# Altium schematic sheet 10 - Configuration And ADC.SchDoc: Configuration and ADC
size A3; Page Number: 10; Page Size: B; Page Count: 12; Board Rev: B; Project Name: CrossLink-NX Evaluation Board; RevCode: 1.0; Doc: 305-PD-19-0819; DsnPath: C:\Users\HAltinkilit\Downloads\Crosslink-NX-Design-Files\CrossLink-NX-Eval-Brd-Schematic-RevB-191122.DSN; SchematicName: SCHEMATIC1; PageName: 09 - Configuration And ADC; PageSize: B; TopSchematic: True
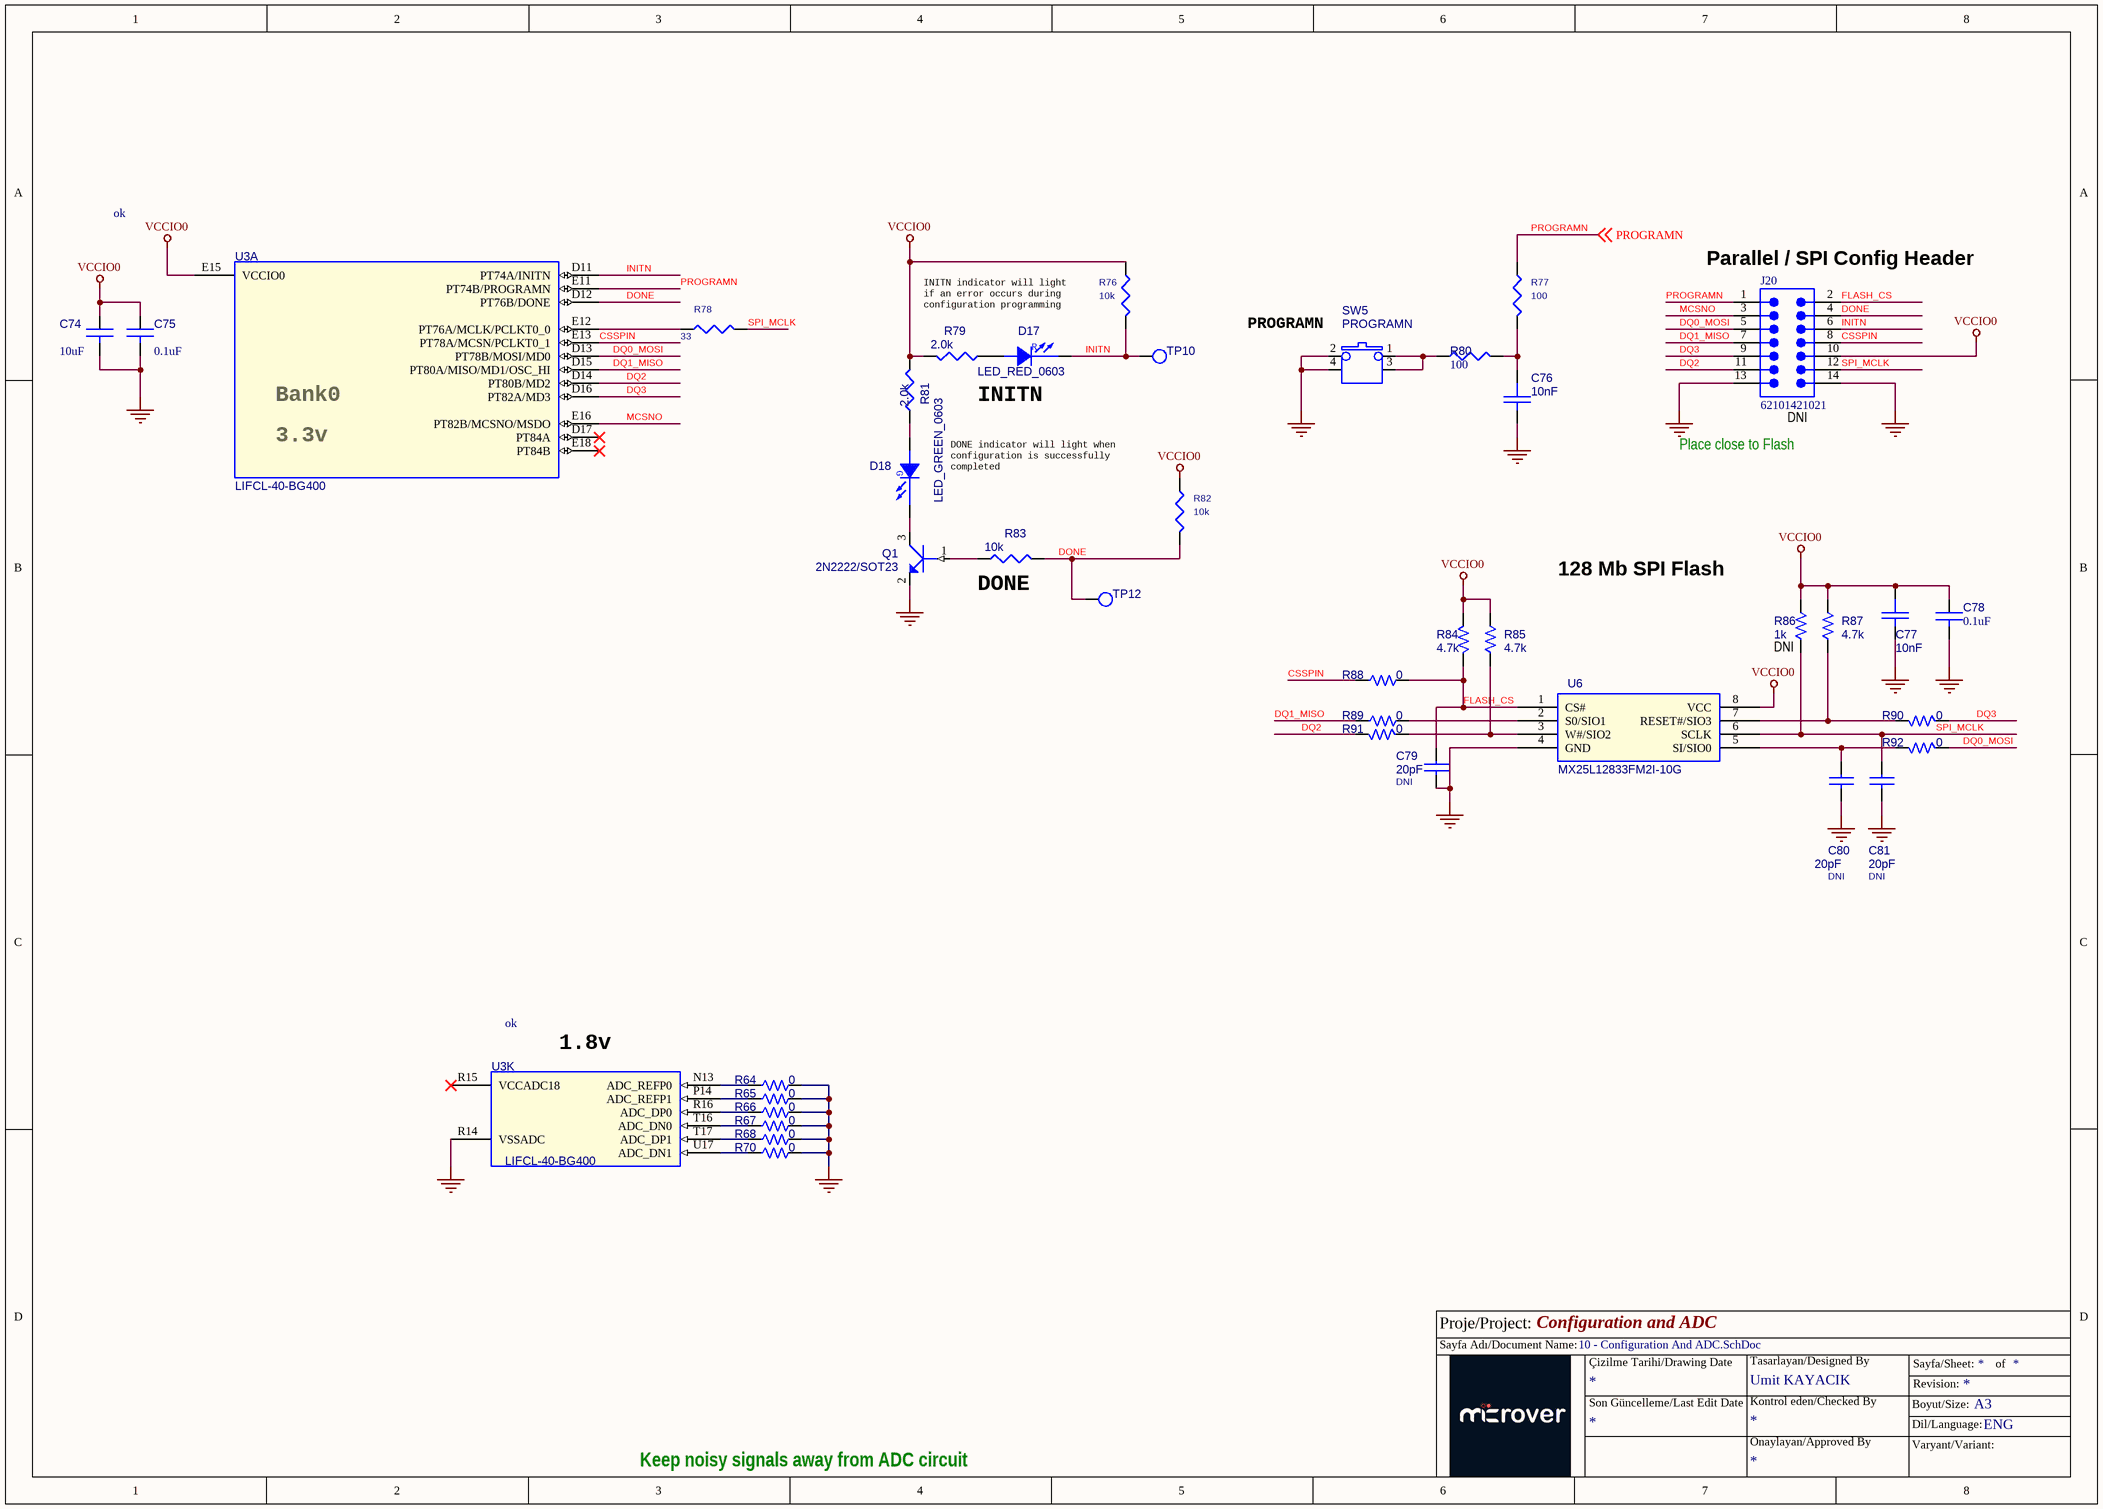
[diagram p0: 10 - Configuration And ADC.SchDoc]

## Parts
C74  10uF  [C0603]
C75  0.1uF  [C0201]
C76  10nF  [RLP-130-A]
C77  10nF  [RLP-130-A]
C78  0.1uF  [C0402]
C79  20pF  populate: DNI  [C0402]
C80  20pF  populate: DNI  [C0402]
C81  20pF  populate: DNI  [c0402]
D17  LED_RED_0603  [APT1608]
D18  LED_GREEN_0603  [APT1608]
J20  62101421021  [62101421021]
Q1  2N2222/SOT23  [MMBT2222ALT-1]
R64  0  [R0201]
R65  0  [R0201]
R66  0  [R0201]
R67  0  [R0201]
R68  0  [R0201]
R70  0  [R0201]
R76  10k  [R0402]
R77  100  [R0402]
R78  33  [R0402]
R79  2.0k  [R0402]
R80  100  [R0402]
R81  2.0k  [R0402]
R82  10k  [R0402]
R83  10k  [R0402]
R84  4.7k  [R0402]
R85  4.7k  [R0402]
R86  1k  [R0402]
R87  4.7k  [R0402]
R88  0  [R0402]
R89  0  [R0402]
R90  0  [R0402]
R91  0  [R0402]
R92  0  [R0402]
SW5  PROGRAMN  [4psmd_switch]
TP10  TestPoint  [TP_1MM]  (value not drawn)
TP12  TestPoint  [TP_1MM]  (value not drawn)
U3  LIFCL-40-BG400  [LIFCL-40-BG400]  (parts A,K of 15)
U6  MX25L12833FM2I-10G  [SO8_MX25L12833FM2I10G]

## Nets
GND: C74.2 C75.2 C76.2 C77.2 C78.2 C79.2 C80.2 C81.2 J20.13 J20.14 Q1.2(EMITTER) R64.2 R65.2 R66.2 R67.2 R68.2 R70.2 SW5.2 SW5.4 U3.R14(VSSADC) U6.4(GND)
VCCIO0: C74.1 C75.1 C77.1 C78.1 J20.10 R76.1 R79.2 R81.2 R82.1 R84.2 R85.2 R86.2 R87.2 U3.E15(VCCIO0) U6.8(VCC)
CSSPIN: J20.8 R88.1 U3.E13(PT78A/MCSN/PCLKT0_1)
DONE: J20.4 R82.2 R83.2 TP12.1(TP) U3.D12(PT76B/DONE)
DQ0_MOSI: J20.5 R92.1 U3.D13(PT78B/MOSI/MD0)
DQ1_MISO: J20.7 R89.1 U3.D15(PT80A/MISO/MD1/OSC_HI)
DQ2: J20.11 R91.2 U3.D14(PT80B/MD2)
DQ3: J20.9 R90.1 U3.D16(PT82A/MD3)
FLASH_CS: C79.1 J20.2 R84.1 R88.2 U6.1(CS#)
INITN: D17.1(CATHODE) J20.6 R76.2 TP10.1(TP) U3.D11(PT74A/INITN)
MCSNO: J20.3 U3.E16(PT82B/MCSNO/MSDO)
PROGRAMN: J20.1 R77.1 U3.E11(PT74B/PROGRAMN) ; off-sheet PROGRAMN
SPI_MCLK: C81.1 J20.12 R78.1 R86.1 U6.6(SCLK)
NetC76_1: C76.1 R77.2 R80.2
NetC80_1: C80.1 R92.2 U6.5(SI/SIO0)
NetD17_2: D17.2(ANODE) R79.1
NetD18_1: D18.1(CATHODE) Q1.3(COLLECTOR)
NetD18_2: D18.2(ANODE) R81.1
NetQ1_1: Q1.1(BASE) R83.1
NetR64_1: R64.1 U3.N13(ADC_REFP0)
NetR65_1: R65.1 U3.P14(ADC_REFP1)
NetR66_1: R66.1 U3.R16(ADC_DP0)
NetR67_1: R67.1 U3.T16(ADC_DN0)
NetR68_1: R68.1 U3.T17(ADC_DP1)
NetR70_1: R70.1 U3.U17(ADC_DN1)
NetR78_2: R78.2 U3.E12(PT76A/MCLK/PCLKT0_0)
NetR80_1: R80.1 SW5.1 SW5.3
NetR85_1: R85.1 R91.1 U6.3(W#/SIO2)
NetR87_1: R87.1 R90.2 U6.7(RESET#/SIO3)
NetR89_2: R89.2 U6.2(S0/SIO1)

Not connected (* = marked no-connect by the designer): U3 D17(PT84A)* E18(PT84B)* R15(VCCADC18)*

## Notes on the sheet
- ok
- (near R76) INITN indicator will light
  if an error occurs during
  configuration programming
- (near J20) Parallel / SPI Config Header
- (near SW5) PROGRAMN
- (near U3) 3.3v
- (near U3) Bank0
- INITN
- Place close to Flash
- (near J20) DNI
- DONE indicator will light when
  configuration is successfully
  completed
- 128 Mb SPI Flash
- (near R83) DONE
- (near R86) DNI
- (near U3) 1.8v
- Keep noisy signals away from ADC circuit
- Proje/Project:
- Sayfa Adı/Document Name:
- Çizilme Tarihi/Drawing Date
- Umit KAYACIK
- Tasarlayan/Designed By
- Sayfa/Sheet:
- Revision:
- of
- Son Güncelleme/Last Edit Date
- Kontrol eden/Checked By
- Onaylayan/Approved By
- Boyut/Size:
- Varyant/Variant:
- Dil/Language:
- A3
- ENG
- (in symbol LED-SMT1206_GREEN_1) G
- (in symbol LED-SMT1206_RED_0) R

## Library data of the parts
C74 = 10uF_0603: CAP CECAP CER 10UF 10V X5R 20% 0603; Manufacturer: Taiyo Yuden; Manufacturer Part Number: LMK107BJ106MALTD; Part Reference: C74; Class: Discrete; Digikey P/N: 587-2562-1-ND; Assy: -; Value: 10uF; PCB Footprint: C0603
C75 = 0u1_0402: CAP CER 0.1UF 25V 10% X5R 0201; Manufacturer: Murata; Manufacturer Part Number: GRM033R61E104KE14J; Part Reference: C75; Class: Discrete; Digikey P/N: 399-3521-2-ND; Assy: -; Value: 0.1uF; PCB Footprint: C0201
C76 = CAP_1: Part Reference: C76; Value: 10nF; Assy: -; PCB Footprint: RLP-130-A
C77 = CAP_1: Part Reference: C77; Value: 10nF; PCB Footprint: RLP-130-A; Assy: -
C78 = 0u1_0402: CAP CER 0.1UF 25V 10% X5R 0402; Manufacturer: Murata; Manufacturer Part Number: GRM033R61E104KE14J; Part Reference: C78; Class: Discrete; PCB Footprint: C0201; Digikey P/N: 399-3521-2-ND; Assy: -; Value: 0.1uF
C79 = CAP NP_Dup1: Part Reference: C79; Assy: DNI; COMPHEIGHT: 0.000; MEMORY: NO; COMPGROUP: 0; COMPROT: 270; COMPLOC: [1820.000,2015.000]; COMPSIDE: TOP; FPLIST: SM/C_0402; PCB Footprint: RLP-132; Value: 20pF; DECOUPLER: NO; COMPKEY: NO; COMPLOCKED: NO; COMPFIXED: NO
C80 = CAP NP_Dup1: Part Reference: C80; COMPHEIGHT: 0.000; MEMORY: NO; COMPGROUP: 0; COMPROT: 270; COMPLOC: [1820.000,2015.000]; COMPSIDE: TOP; FPLIST: SM/C_0402; Assy: DNI; PCB Footprint: RLP-132; Value: 20pF; DECOUPLER: NO; COMPKEY: NO; COMPLOCKED: NO; COMPFIXED: NO
C81 = CAP NP_Dup1: Part Reference: C81; Assy: DNI; COMPHEIGHT: 0.000; MEMORY: NO; COMPGROUP: 0; COMPROT: 270; COMPLOC: [1820.000,2015.000]; COMPSIDE: TOP; FPLIST: SM/C_0402; PCB Footprint: RLP-132; Value: 20pF; DECOUPLER: NO; COMPKEY: NO; COMPLOCKED: NO; COMPFIXED: NO
D17 = LED-SMT1206_RED_0: Part Reference: D17; Value: LED_RED_0603; Assy: -; PCB Footprint: APT1608
D18 = LED-SMT1206_GREEN_1: Part Reference: D18; Value: LED_GREEN_0603; Assy: -; PCB Footprint: APT1608
J20 = CMP-1502-00928-4: Conn, Header, 14Pos, 2Row, 1.27Mm Rohs Compliant: Yes; Contact Resistance: 20mΩ; Gender: Male; Current Rating: 1A; Operating Supply Voltage: 100V; Orientation: Vertical; RoHS: Non-Compliant; Lead Pitch: 1.27mm; Number of Pins: 14
Q1 = 2N2222: Part Reference: Q1; Value: 2N2222/SOT23; Assy: -; PCB Footprint: MMBT2222ALT-1
R64-R68 R70 = R_Dup2: RES SMD 0.0OHM JUMPER 1/10W 0402; Part Reference: R88; Manufacturer Part Number: ERJ-2GE0R00X; Manufacturer: Panasonic; DIST: FLAT; PSpiceTemplate: R^@REFDES %1 %2 ?TOLERANCE|R^@REFDES| @VALUE  ?TOLERANCE|\n.model R^@REFDES RES R=1 DEV=@TOLERANCE%|; VOLTAGE: RVMAX; SLOPE: RSMAX; MAX_TEMP: RTMAX; POWER: RMAX; FPLIST: AX/RC05; COMPSIDE: TOP; COMPLOC: [3325.000,1400.000]; COMPROT: 180; COMPFIXED: NO; COMPHEIGHT: 0.000; PCB Footprint: R0402; Value: 0; Assy: -; COMPGROUP: 0; COMPLOCKED: NO; COMPKEY: NO; DECOUPLER: NO; MEMORY: NO
R76 = R_Dup3: RES SMD 10K OHM 1% 1/16W 0402; Part Reference: R76; Manufacturer Part Number: RC0402FR-0710KL; MFG: Yageo; Value: 10k; Assy: -; Manufacturer: Yageo; MFG P/N: RC0402FR-0710KL; PCB Footprint: R0402
R77 = R_Dup3: RES SMD 100 OHM 1% 1/16W 0402; Part Reference: R77; Manufacturer Part Number: RC0402FR-07100RL; MFG: Yageo; Value: 100; Assy: -; Manufacturer: Yageo; MFG P/N: RC0402FR-07100RL; PCB Footprint: R0402
R78 = R_Dup3: RES SMD 33 OHM 1% 1/10W 0402; Part Reference: R78; Manufacturer Part Number: ERJ-2RKF33R0X; Manufacturer: Panasonic; Value: 33; Assy: -; PCB Footprint: R0402
R79 = RES_0: RES SMD 1K OHM 1% 1/10W 0402; Part Reference: R79; Manufacturer Part Number: ERJ-2RKF1001X; Manufacturer: Panasonic; Value: 2.0k; Assy: -; PCB Footprint: R0402
R80 = 0R_0603: RES SMD 100 OHM 1% 1/16W 0402; Manufacturer: Yageo; Manufacturer Part Number: RC0402FR-07100RL; Part Reference: R80; Class: Discrete; Digikey P/N: 311-0.0GRTR-ND; Assy: -; Value: 100; MFG: Yageo; MFG P/N: RC0402FR-07100RL; PCB Footprint: R0402
R81 = RES_0: RES SMD 1K OHM 1% 1/10W 0402; Part Reference: R81; Manufacturer: Panasonic; Manufacturer Part Number: ERJ-2RKF1001X; Value: 2.0k; Assy: -; PCB Footprint: R0402
R82 = R_Dup3: RES SMD 10K OHM 1% 1/16W 0402; Part Reference: R82; Manufacturer Part Number: RC0402FR-0710KL; MFG: Yageo; Value: 10k; Assy: -; Manufacturer: Yageo; MFG P/N: RC0402FR-0710KL; PCB Footprint: R0402
R83 = RES_0: RES SMD 10K OHM 1% 1/16W 0402; Part Reference: R83; Manufacturer: Yageo; MFG P/N: RC0402FR-0710KL; Value: 10k; Assy: -; MFG: Yageo; Manufacturer Part Number: RC0402FR-0710KL; PCB Footprint: R0402
R84 = R_Dup2: RES SMD 4.7K OHM 5% 1/10W 0402; Part Reference: R84; Manufacturer: Panasonic; DIST: FLAT; PSpiceTemplate: R^@REFDES %1 %2 ?TOLERANCE|R^@REFDES| @VALUE  ?TOLERANCE|\n.model R^@REFDES RES R=1 DEV=@TOLERANCE%|; VOLTAGE: RVMAX; SLOPE: RSMAX; MAX_TEMP: RTMAX; POWER: RMAX; MFG P/N: ERJ-2GEJ472X; COMPHEIGHT: 0.000; MEMORY: NO; COMPGROUP: 0; COMPROT: 180; COMPLOC: [970.000,1160.000]; COMPSIDE: TOP; FPLIST: AX/RC05,SM/R_0603; Value: 4.7k; Assy: -; MFG: Panasonic; Manufacturer Part Number: ERJ-2GEJ472X; DECOUPLER: NO; COMPKEY: NO; COMPLOCKED: NO; COMPFIXED: NO; PCB Footprint: R0402
R85 = R_Dup2: RES SMD 4.7K OHM 5% 1/10W 0402; Part Reference: R85; Manufacturer: Panasonic; DIST: FLAT; PSpiceTemplate: R^@REFDES %1 %2 ?TOLERANCE|R^@REFDES| @VALUE  ?TOLERANCE|\n.model R^@REFDES RES R=1 DEV=@TOLERANCE%|; VOLTAGE: RVMAX; SLOPE: RSMAX; MAX_TEMP: RTMAX; POWER: RMAX; MFG P/N: ERJ-2GEJ472X; COMPHEIGHT: 0.000; MEMORY: NO; COMPGROUP: 0; COMPROT: 180; COMPLOC: [970.000,1160.000]; COMPSIDE: TOP; FPLIST: AX/RC05,SM/R_0603; Value: 4.7k; Assy: -; MFG: Panasonic; Manufacturer Part Number: ERJ-2GEJ472X; DECOUPLER: NO; COMPKEY: NO; COMPLOCKED: NO; COMPFIXED: NO; PCB Footprint: R0402
R86 = R_Dup2: RES SMD 1K OHM 1% 1/10W 0402; Part Reference: R86; Manufacturer Part Number: ERJ-2RKF1001X; Manufacturer: Panasonic; DIST: FLAT; PSpiceTemplate: R^@REFDES %1 %2 ?TOLERANCE|R^@REFDES| @VALUE  ?TOLERANCE|\n.model R^@REFDES RES R=1 DEV=@TOLERANCE%|; VOLTAGE: RVMAX; SLOPE: RSMAX; MAX_TEMP: RTMAX; POWER: RMAX; Assy: DNI; COMPHEIGHT: 0.000; MEMORY: NO; COMPGROUP: 0; COMPROT: 180; COMPLOC: [970.000,1160.000]; COMPSIDE: TOP; FPLIST: AX/RC05,SM/R_0603; Value: 1k; DECOUPLER: NO; COMPKEY: NO; COMPLOCKED: NO; COMPFIXED: NO; PCB Footprint: R0402
R87 = R_Dup2: RES SMD 4.7K OHM 5% 1/10W 0402; Part Reference: R87; Manufacturer: Panasonic; DIST: FLAT; PSpiceTemplate: R^@REFDES %1 %2 ?TOLERANCE|R^@REFDES| @VALUE  ?TOLERANCE|\n.model R^@REFDES RES R=1 DEV=@TOLERANCE%|; VOLTAGE: RVMAX; SLOPE: RSMAX; MAX_TEMP: RTMAX; POWER: RMAX; MFG P/N: ERJ-2GEJ472X; FPLIST: AX/RC05,SM/R_0603; COMPSIDE: TOP; COMPLOC: [970.000,1160.000]; COMPROT: 180; COMPGROUP: 0; COMPFIXED: NO; COMPHEIGHT: 0.000; Value: 4.7k; Assy: -; MFG: Panasonic; Manufacturer Part Number: ERJ-2GEJ472X; COMPLOCKED: NO; COMPKEY: NO; DECOUPLER: NO; MEMORY: NO; PCB Footprint: R0402
R88 = R_Dup2: RES SMD 0.0OHM JUMPER 1/10W 0402; Part Reference: R88; Manufacturer Part Number: ERJ-2GE0R00X; Manufacturer: Panasonic; DIST: FLAT; PSpiceTemplate: R^@REFDES %1 %2 ?TOLERANCE|R^@REFDES| @VALUE  ?TOLERANCE|\n.model R^@REFDES RES R=1 DEV=@TOLERANCE%|; VOLTAGE: RVMAX; SLOPE: RSMAX; MAX_TEMP: RTMAX; POWER: RMAX; FPLIST: AX/RC05; COMPSIDE: TOP; COMPLOC: [3325.000,1400.000]; COMPROT: 180; COMPFIXED: NO; COMPHEIGHT: 0.000; Value: 0; Assy: -; COMPGROUP: 0; COMPLOCKED: NO; COMPKEY: NO; DECOUPLER: NO; MEMORY: NO; PCB Footprint: R0402
R89 = R_Dup2: RES SMD 0.0OHM JUMPER 1/10W 0402; Part Reference: R89; Manufacturer Part Number: ERJ-2GE0R00X; Manufacturer: Panasonic; DIST: FLAT; PSpiceTemplate: R^@REFDES %1 %2 ?TOLERANCE|R^@REFDES| @VALUE  ?TOLERANCE|\n.model R^@REFDES RES R=1 DEV=@TOLERANCE%|; VOLTAGE: RVMAX; SLOPE: RSMAX; MAX_TEMP: RTMAX; POWER: RMAX; FPLIST: AX/RC05; COMPSIDE: TOP; COMPLOC: [3325.000,1400.000]; COMPROT: 180; COMPFIXED: NO; COMPHEIGHT: 0.000; Value: 0; Assy: -; COMPGROUP: 0; COMPLOCKED: NO; COMPKEY: NO; DECOUPLER: NO; MEMORY: NO; PCB Footprint: R0402
R90 = R_Dup2: RES SMD 0.0OHM JUMPER 1/10W 0402; Part Reference: R90; Manufacturer Part Number: ERJ-2GE0R00X; Manufacturer: Panasonic; DIST: FLAT; PSpiceTemplate: R^@REFDES %1 %2 ?TOLERANCE|R^@REFDES| @VALUE  ?TOLERANCE|\n.model R^@REFDES RES R=1 DEV=@TOLERANCE%|; VOLTAGE: RVMAX; SLOPE: RSMAX; MAX_TEMP: RTMAX; POWER: RMAX; COMPHEIGHT: 0.000; MEMORY: NO; COMPROT: 180; COMPLOC: [3325.000,1400.000]; COMPSIDE: TOP; FPLIST: AX/RC05; Value: 0; Assy: -; DECOUPLER: NO; COMPKEY: NO; COMPLOCKED: NO; COMPFIXED: NO; COMPGROUP: 0; PCB Footprint: R0402
R91 = R_Dup2: RES SMD 0.0OHM JUMPER 1/10W 0402; Part Reference: R91; Manufacturer Part Number: ERJ-2GE0R00X; Manufacturer: Panasonic; DIST: FLAT; PSpiceTemplate: R^@REFDES %1 %2 ?TOLERANCE|R^@REFDES| @VALUE  ?TOLERANCE|\n.model R^@REFDES RES R=1 DEV=@TOLERANCE%|; VOLTAGE: RVMAX; SLOPE: RSMAX; MAX_TEMP: RTMAX; POWER: RMAX; COMPHEIGHT: 0.000; MEMORY: NO; COMPROT: 180; COMPLOC: [3325.000,1400.000]; COMPSIDE: TOP; FPLIST: AX/RC05; Value: 0; Assy: -; DECOUPLER: NO; COMPKEY: NO; COMPLOCKED: NO; COMPFIXED: NO; COMPGROUP: 0; PCB Footprint: R0402
R92 = R_Dup2: RES SMD 0.0OHM JUMPER 1/10W 0402; Part Reference: R92; Manufacturer Part Number: ERJ-2GE0R00X; Manufacturer: Panasonic; DIST: FLAT; PSpiceTemplate: R^@REFDES %1 %2 ?TOLERANCE|R^@REFDES| @VALUE  ?TOLERANCE|\n.model R^@REFDES RES R=1 DEV=@TOLERANCE%|; VOLTAGE: RVMAX; SLOPE: RSMAX; MAX_TEMP: RTMAX; POWER: RMAX; FPLIST: AX/RC05; COMPSIDE: TOP; COMPLOC: [3325.000,1400.000]; COMPROT: 180; COMPFIXED: NO; COMPHEIGHT: 0.000; Value: 0; Assy: -; COMPGROUP: 0; COMPLOCKED: NO; COMPKEY: NO; DECOUPLER: NO; MEMORY: NO; PCB Footprint: R0402
SW5 = SW PUSHBUTTON-SPST/SM: SWITCH TACTILE SPST-NO 0.05A 12V; Part Reference: SW5; Manufacturer Part Number: 434153017835; MFG: Wurth; Value: PROGRAMN; Assy: -; Man. Part #: 434153017835; Manufacturer: Wurth; MFG P/N: 434153017835; PCB Footprint: 4psmd_switch
TP10 = T POINT R: Part Reference: TP10; PCB Footprint: TP50; Value: TestPoint; Assy: -
TP12 = T POINT R: Part Reference: TP12; PCB Footprint: TP50; Value: TestPoint; Assy: -
U3 = LIFCL-40-BG400: Part Reference: U3; SWAP_INFO: (S1+S2+S3+S4+S5+S6+S7+S8+S9+S10+S11+S12+S13+S14+S15); SPLIT_INST: TRUE; Value: LIFCL-40-BG400; Assy: -; PCB Footprint: LIFCL-40-BG400
U6 = N25QxxxA13xF8_0: IC FLASH 128MBIT 104MHZ 8SOP; Part Reference: U6; Manufacturer: Macronix; Populate: DI; Value: MX25L12833FM2I-10G; Assy: -; Manufacturer Part Number: MX25L12833FM2I-10G; PCB Footprint: SO8_MX25L12833FM2I10G